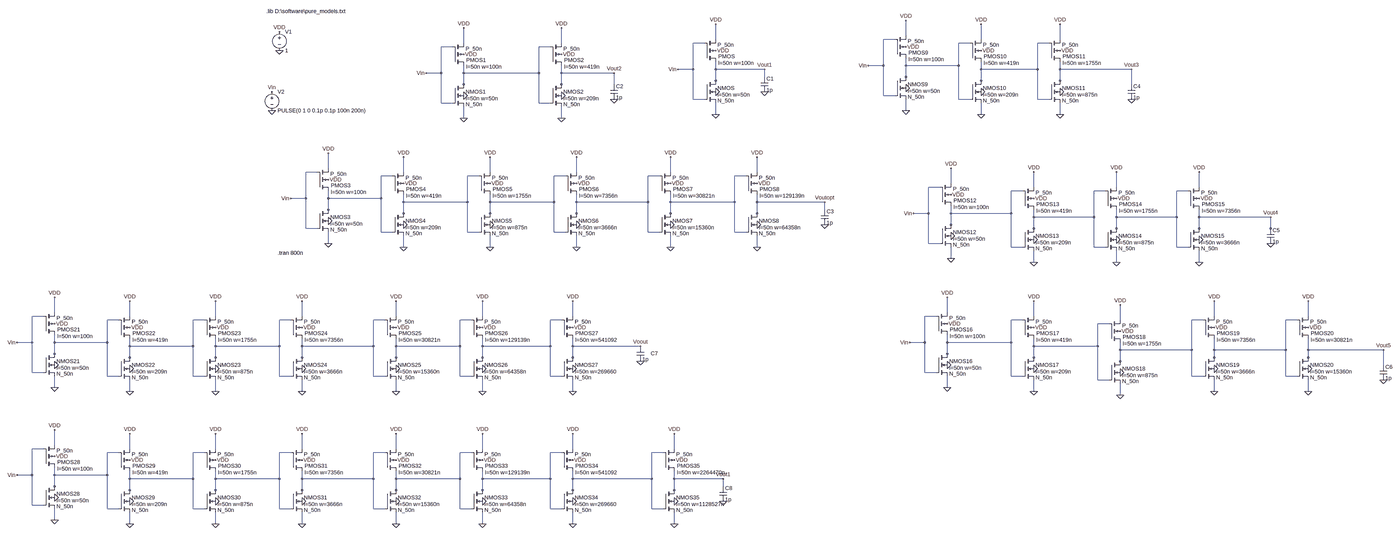
[diagram p0: schematic lab05a2.asc, whole sheet]
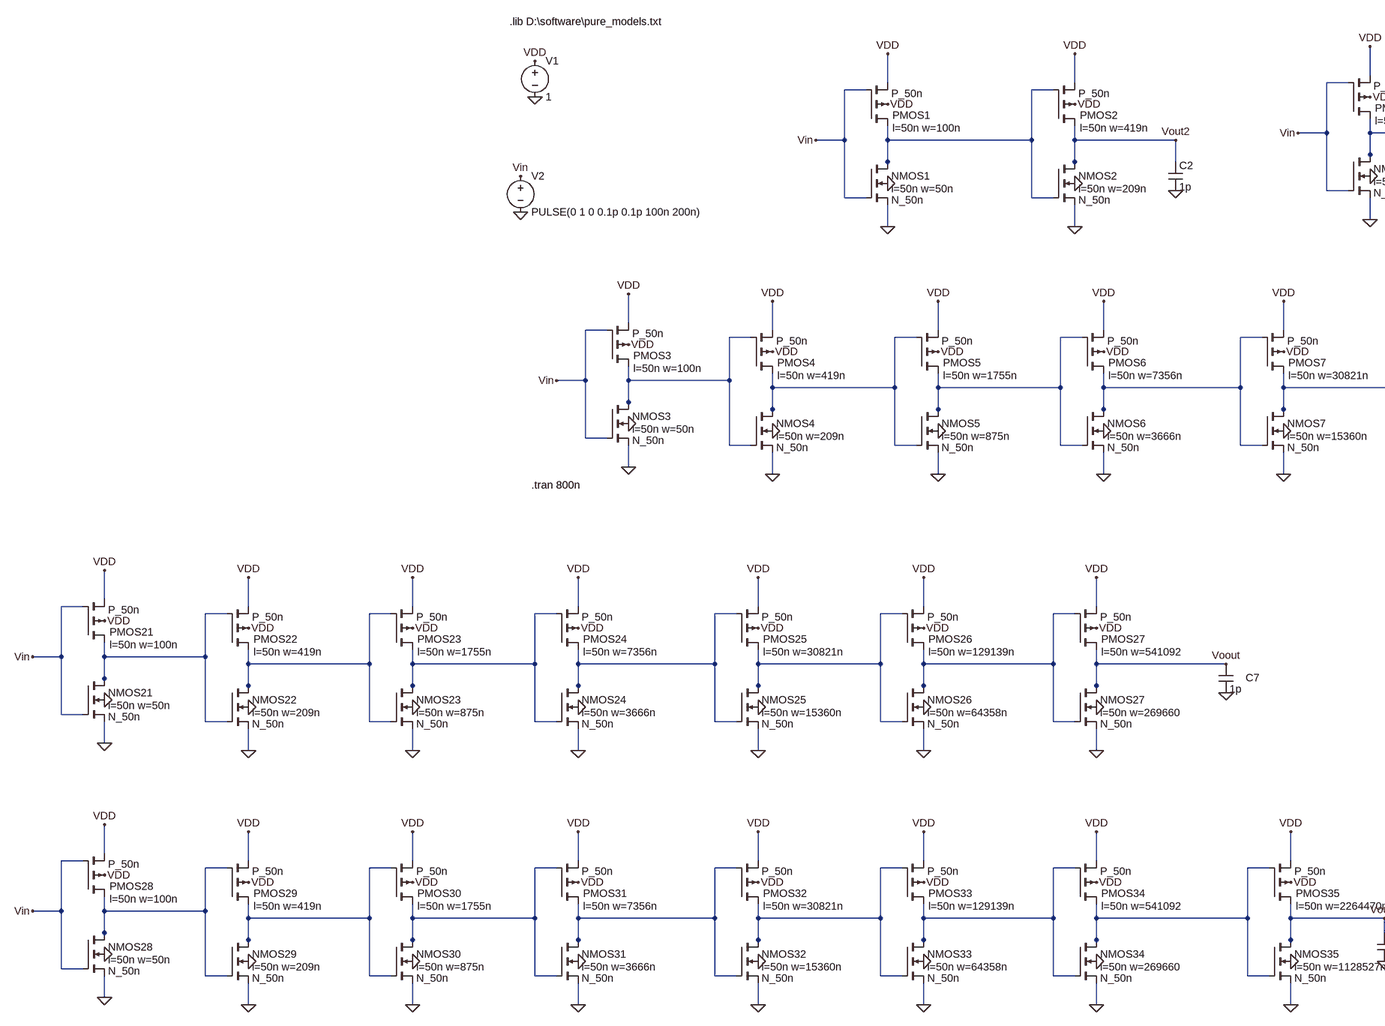
[diagram p1: schematic lab05a2.asc, part, row 1 of 1, column 1 of 2]
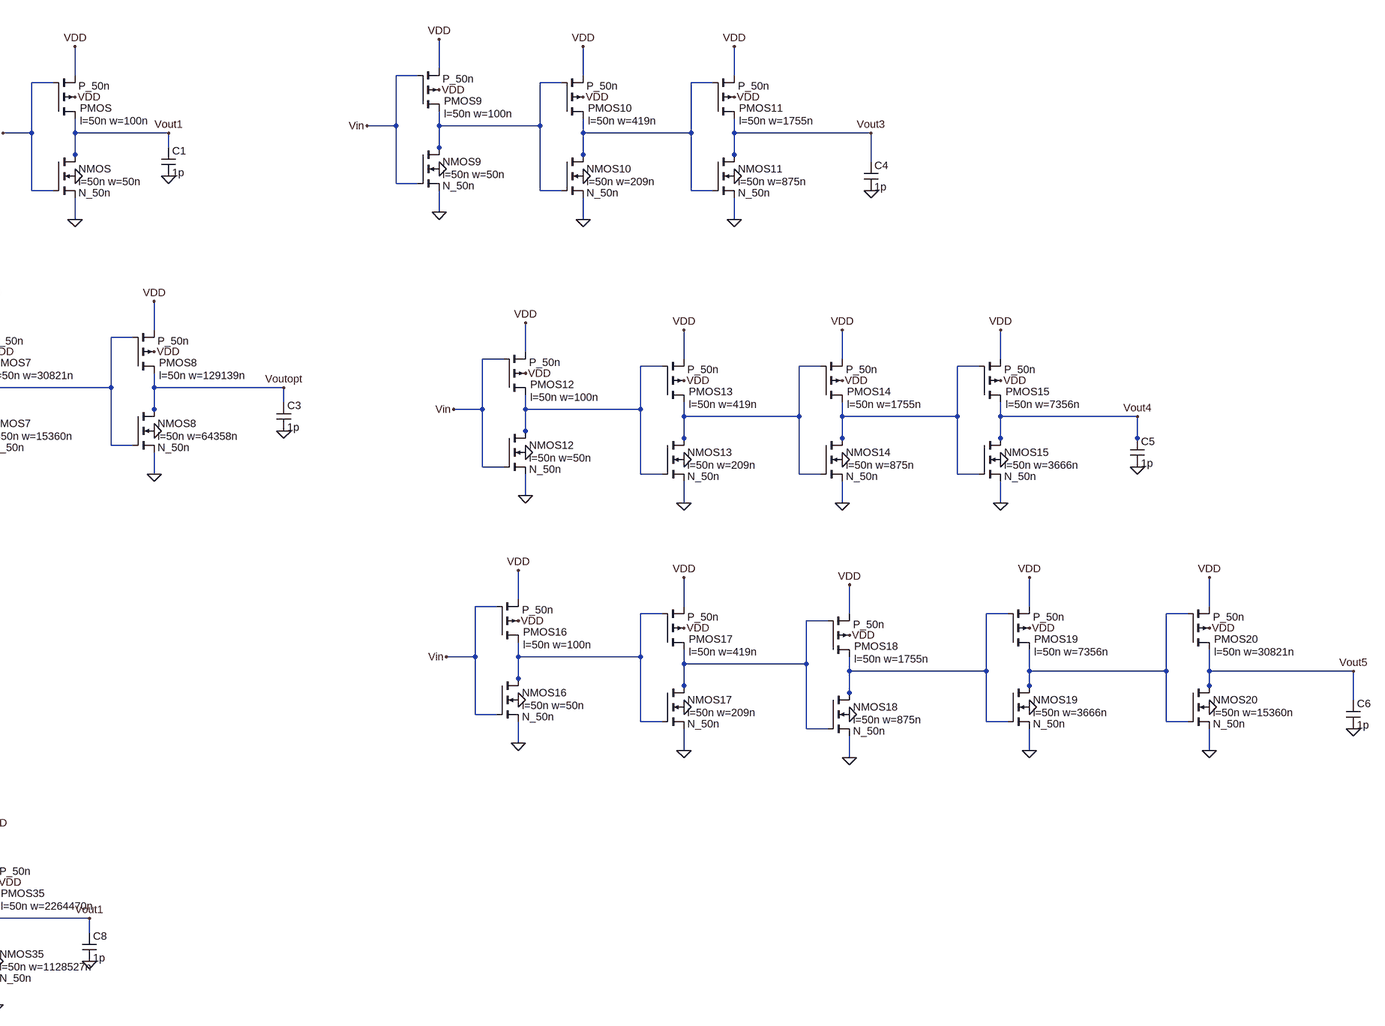
[diagram p2: schematic lab05a2.asc, part, row 1 of 1, column 2 of 2]
lab05a2.asc, the LTspice schematic file:
Version 4
SHEET 1 3972 2004
WIRE 1888 -352 1888 -416
WIRE 992 -336 992 -400
WIRE 1840 -336 1792 -336
WIRE 2208 -336 2208 -400
WIRE 2544 -336 2544 -400
WIRE -80 -320 -80 -384
WIRE 336 -320 336 -384
WIRE 944 -320 896 -320
WIRE 2160 -320 2112 -320
WIRE 2496 -320 2448 -320
WIRE -128 -304 -176 -304
WIRE 288 -304 240 -304
WIRE 1792 -224 1792 -336
WIRE 1792 -224 1728 -224
WIRE 1888 -224 1888 -256
WIRE 2112 -224 2112 -320
WIRE 2112 -224 1888 -224
WIRE 896 -208 896 -320
WIRE 896 -208 832 -208
WIRE 992 -208 992 -240
WIRE 1200 -208 992 -208
WIRE 2208 -208 2208 -240
WIRE 2448 -208 2448 -320
WIRE 2448 -208 2208 -208
WIRE 2544 -208 2544 -240
WIRE 2848 -208 2544 -208
WIRE -176 -192 -176 -304
WIRE -176 -192 -240 -192
WIRE -80 -192 -80 -224
WIRE 240 -192 240 -304
WIRE 240 -192 -80 -192
WIRE 336 -192 336 -224
WIRE 560 -192 336 -192
WIRE 1200 -176 1200 -208
WIRE 1888 -176 1888 -224
WIRE 992 -160 992 -208
WIRE 1888 -160 1888 -176
WIRE 2208 -160 2208 -208
WIRE 2544 -160 2544 -208
WIRE -80 -144 -80 -192
WIRE 336 -144 336 -192
WIRE 560 -144 560 -192
WIRE 992 -144 992 -160
WIRE 2208 -144 2208 -160
WIRE 2544 -144 2544 -160
WIRE 2848 -144 2848 -208
WIRE -80 -128 -80 -144
WIRE 336 -128 336 -144
WIRE 1792 -96 1792 -224
WIRE 1840 -96 1792 -96
WIRE 896 -80 896 -208
WIRE 944 -80 896 -80
WIRE 2112 -80 2112 -224
WIRE 2160 -80 2112 -80
WIRE 2448 -80 2448 -208
WIRE 2496 -80 2448 -80
WIRE -176 -64 -176 -192
WIRE -128 -64 -176 -64
WIRE 240 -64 240 -192
WIRE 288 -64 240 -64
WIRE 1888 -32 1888 -80
WIRE 992 -16 992 -64
WIRE 2208 -16 2208 -64
WIRE 2544 -16 2544 -64
WIRE -80 0 -80 -48
WIRE 336 0 336 -48
WIRE -656 304 -656 240
WIRE -704 320 -752 320
WIRE -336 320 -336 256
WIRE 32 320 32 256
WIRE 400 320 400 256
WIRE 800 320 800 256
WIRE 1168 320 1168 256
WIRE -384 336 -432 336
WIRE -16 336 -64 336
WIRE 352 336 304 336
WIRE 752 336 704 336
WIRE 1120 336 1072 336
WIRE 2080 368 2080 304
WIRE 2032 384 1984 384
WIRE 2432 384 2432 320
WIRE 2784 384 2784 320
WIRE 3136 384 3136 320
WIRE 2384 400 2336 400
WIRE 2736 400 2688 400
WIRE 3088 400 3040 400
WIRE -752 432 -752 320
WIRE -752 432 -816 432
WIRE -656 432 -656 400
WIRE -432 432 -432 336
WIRE -432 432 -656 432
WIRE -336 448 -336 416
WIRE -64 448 -64 336
WIRE -64 448 -336 448
WIRE 32 448 32 416
WIRE 304 448 304 336
WIRE 304 448 32 448
WIRE 400 448 400 416
WIRE 704 448 704 336
WIRE 704 448 400 448
WIRE 800 448 800 416
WIRE 1072 448 1072 336
WIRE 1072 448 800 448
WIRE 1168 448 1168 416
WIRE 1456 448 1168 448
WIRE -656 480 -656 432
WIRE 1456 480 1456 448
WIRE -656 496 -656 480
WIRE -336 496 -336 448
WIRE 32 496 32 448
WIRE 400 496 400 448
WIRE 800 496 800 448
WIRE 1168 496 1168 448
WIRE 1984 496 1984 384
WIRE 1984 496 1920 496
WIRE 2080 496 2080 464
WIRE 2336 496 2336 400
WIRE 2336 496 2080 496
WIRE -336 512 -336 496
WIRE 32 512 32 496
WIRE 400 512 400 496
WIRE 800 512 800 496
WIRE 1168 512 1168 496
WIRE 2432 512 2432 480
WIRE 2688 512 2688 400
WIRE 2688 512 2432 512
WIRE 2784 512 2784 480
WIRE 3040 512 3040 400
WIRE 3040 512 2784 512
WIRE 3136 512 3136 480
WIRE 3440 512 3136 512
WIRE 2080 544 2080 496
WIRE -752 560 -752 432
WIRE -704 560 -752 560
WIRE 2080 560 2080 544
WIRE 2432 560 2432 512
WIRE 2784 560 2784 512
WIRE 3136 560 3136 512
WIRE 3440 560 3440 512
WIRE -432 576 -432 432
WIRE -384 576 -432 576
WIRE -64 576 -64 448
WIRE -16 576 -64 576
WIRE 304 576 304 448
WIRE 352 576 304 576
WIRE 704 576 704 448
WIRE 752 576 704 576
WIRE 1072 576 1072 448
WIRE 1120 576 1072 576
WIRE 2432 576 2432 560
WIRE 2784 576 2784 560
WIRE 3136 576 3136 560
WIRE 3440 576 3440 560
WIRE -656 624 -656 576
WIRE 1984 624 1984 496
WIRE 2032 624 1984 624
WIRE -336 640 -336 592
WIRE 32 640 32 592
WIRE 400 640 400 592
WIRE 800 640 800 592
WIRE 1168 640 1168 592
WIRE 2336 640 2336 496
WIRE 2384 640 2336 640
WIRE 2688 640 2688 512
WIRE 2736 640 2688 640
WIRE 3040 640 3040 512
WIRE 3088 640 3040 640
WIRE 2080 688 2080 640
WIRE 2432 704 2432 656
WIRE 2784 704 2784 656
WIRE 3136 704 3136 656
WIRE -1824 1008 -1824 944
WIRE 2064 1008 2064 944
WIRE -1872 1024 -1920 1024
WIRE -1504 1024 -1504 960
WIRE -1136 1024 -1136 960
WIRE -768 1024 -768 960
WIRE -368 1024 -368 960
WIRE 0 1024 0 960
WIRE 384 1024 384 960
WIRE 2016 1024 1968 1024
WIRE 2432 1024 2432 960
WIRE 3200 1024 3200 960
WIRE 3600 1024 3600 960
WIRE -1552 1040 -1600 1040
WIRE -1184 1040 -1232 1040
WIRE -816 1040 -864 1040
WIRE -416 1040 -464 1040
WIRE -48 1040 -96 1040
WIRE 336 1040 288 1040
WIRE 2384 1040 2336 1040
WIRE 2800 1040 2800 976
WIRE 3152 1040 3104 1040
WIRE 3552 1040 3504 1040
WIRE 2752 1056 2704 1056
WIRE -1920 1136 -1920 1024
WIRE -1920 1136 -1984 1136
WIRE -1824 1136 -1824 1104
WIRE -1600 1136 -1600 1040
WIRE -1600 1136 -1824 1136
WIRE 1968 1136 1968 1024
WIRE 1968 1136 1904 1136
WIRE 2064 1136 2064 1104
WIRE 2336 1136 2336 1040
WIRE 2336 1136 2064 1136
WIRE -1504 1152 -1504 1120
WIRE -1232 1152 -1232 1040
WIRE -1232 1152 -1504 1152
WIRE -1136 1152 -1136 1120
WIRE -864 1152 -864 1040
WIRE -864 1152 -1136 1152
WIRE -768 1152 -768 1120
WIRE -464 1152 -464 1040
WIRE -464 1152 -768 1152
WIRE -368 1152 -368 1120
WIRE -96 1152 -96 1040
WIRE -96 1152 -368 1152
WIRE 0 1152 0 1120
WIRE 288 1152 288 1040
WIRE 288 1152 0 1152
WIRE 384 1152 384 1120
WIRE 672 1152 384 1152
WIRE 2432 1152 2432 1120
WIRE 2704 1152 2704 1056
WIRE 2704 1152 2432 1152
WIRE 2800 1168 2800 1136
WIRE 3104 1168 3104 1040
WIRE 3104 1168 2800 1168
WIRE 3200 1168 3200 1120
WIRE 3504 1168 3504 1040
WIRE 3504 1168 3200 1168
WIRE 3600 1168 3600 1120
WIRE 3920 1168 3600 1168
WIRE -1824 1184 -1824 1136
WIRE 2064 1184 2064 1136
WIRE -1824 1200 -1824 1184
WIRE -1504 1200 -1504 1152
WIRE -1136 1200 -1136 1152
WIRE -768 1200 -768 1152
WIRE -368 1200 -368 1152
WIRE 0 1200 0 1152
WIRE 384 1200 384 1152
WIRE 2064 1200 2064 1184
WIRE 2432 1200 2432 1152
WIRE 3200 1200 3200 1168
WIRE 3600 1200 3600 1168
WIRE -1504 1216 -1504 1200
WIRE -1136 1216 -1136 1200
WIRE -768 1216 -768 1200
WIRE -368 1216 -368 1200
WIRE 0 1216 0 1200
WIRE 384 1216 384 1200
WIRE 2432 1216 2432 1200
WIRE 2800 1216 2800 1168
WIRE 3200 1216 3200 1200
WIRE 3600 1216 3600 1200
WIRE 2800 1232 2800 1216
WIRE 3920 1232 3920 1168
WIRE -1920 1264 -1920 1136
WIRE -1872 1264 -1920 1264
WIRE 1968 1264 1968 1136
WIRE 2016 1264 1968 1264
WIRE -1600 1280 -1600 1136
WIRE -1552 1280 -1600 1280
WIRE -1232 1280 -1232 1152
WIRE -1184 1280 -1232 1280
WIRE -864 1280 -864 1152
WIRE -816 1280 -864 1280
WIRE -464 1280 -464 1152
WIRE -416 1280 -464 1280
WIRE -96 1280 -96 1152
WIRE -48 1280 -96 1280
WIRE 288 1280 288 1152
WIRE 336 1280 288 1280
WIRE 2336 1280 2336 1136
WIRE 2384 1280 2336 1280
WIRE 3104 1280 3104 1168
WIRE 3152 1280 3104 1280
WIRE 3504 1280 3504 1168
WIRE 3552 1280 3504 1280
WIRE 2704 1296 2704 1152
WIRE 2752 1296 2704 1296
WIRE -1824 1328 -1824 1280
WIRE 2064 1328 2064 1280
WIRE -1504 1344 -1504 1296
WIRE -1136 1344 -1136 1296
WIRE -768 1344 -768 1296
WIRE -368 1344 -368 1296
WIRE 0 1344 0 1296
WIRE 384 1344 384 1296
WIRE 2432 1344 2432 1296
WIRE 3200 1344 3200 1296
WIRE 3600 1344 3600 1296
WIRE 2800 1360 2800 1312
WIRE -1824 1648 -1824 1584
WIRE -1872 1664 -1920 1664
WIRE -1504 1664 -1504 1600
WIRE -1136 1664 -1136 1600
WIRE -768 1664 -768 1600
WIRE -368 1664 -368 1600
WIRE 0 1664 0 1600
WIRE 384 1664 384 1600
WIRE 816 1664 816 1600
WIRE -1552 1680 -1600 1680
WIRE -1184 1680 -1232 1680
WIRE -816 1680 -864 1680
WIRE -416 1680 -464 1680
WIRE -48 1680 -96 1680
WIRE 336 1680 288 1680
WIRE 768 1680 720 1680
WIRE -1920 1776 -1920 1664
WIRE -1920 1776 -1984 1776
WIRE -1824 1776 -1824 1744
WIRE -1600 1776 -1600 1680
WIRE -1600 1776 -1824 1776
WIRE -1504 1792 -1504 1760
WIRE -1232 1792 -1232 1680
WIRE -1232 1792 -1504 1792
WIRE -1136 1792 -1136 1760
WIRE -864 1792 -864 1680
WIRE -864 1792 -1136 1792
WIRE -768 1792 -768 1760
WIRE -464 1792 -464 1680
WIRE -464 1792 -768 1792
WIRE -368 1792 -368 1760
WIRE -96 1792 -96 1680
WIRE -96 1792 -368 1792
WIRE 0 1792 0 1760
WIRE 288 1792 288 1680
WIRE 288 1792 0 1792
WIRE 384 1792 384 1760
WIRE 720 1792 720 1680
WIRE 720 1792 384 1792
WIRE 816 1792 816 1760
WIRE 1024 1792 816 1792
WIRE -1824 1824 -1824 1776
WIRE 1024 1824 1024 1792
WIRE -1824 1840 -1824 1824
WIRE -1504 1840 -1504 1792
WIRE -1136 1840 -1136 1792
WIRE -768 1840 -768 1792
WIRE -368 1840 -368 1792
WIRE 0 1840 0 1792
WIRE 384 1840 384 1792
WIRE 816 1840 816 1792
WIRE -1504 1856 -1504 1840
WIRE -1136 1856 -1136 1840
WIRE -768 1856 -768 1840
WIRE -368 1856 -368 1840
WIRE 0 1856 0 1840
WIRE 384 1856 384 1840
WIRE 816 1856 816 1840
WIRE -1920 1904 -1920 1776
WIRE -1872 1904 -1920 1904
WIRE -1600 1920 -1600 1776
WIRE -1552 1920 -1600 1920
WIRE -1232 1920 -1232 1792
WIRE -1184 1920 -1232 1920
WIRE -864 1920 -864 1792
WIRE -816 1920 -864 1920
WIRE -464 1920 -464 1792
WIRE -416 1920 -464 1920
WIRE -96 1920 -96 1792
WIRE -48 1920 -96 1920
WIRE 288 1920 288 1792
WIRE 336 1920 288 1920
WIRE 720 1920 720 1792
WIRE 768 1920 720 1920
WIRE -1824 1968 -1824 1920
WIRE -1504 1984 -1504 1936
WIRE -1136 1984 -1136 1936
WIRE -768 1984 -768 1936
WIRE -368 1984 -368 1936
WIRE 0 1984 0 1936
WIRE 384 1984 384 1936
WIRE 816 1984 816 1936
FLAG 992 -16 0
FLAG -896 -32 0
FLAG -864 -288 0
FLAG -864 -368 VDD
FLAG 992 -400 VDD
FLAG 992 -288 VDD
FLAG 992 -112 0
FLAG -896 -112 Vin
FLAG 832 -208 Vin
FLAG 1200 -112 0
FLAG -80 0 0
FLAG -80 -384 VDD
FLAG -80 -272 VDD
FLAG -80 -96 0
FLAG -240 -192 Vin
FLAG 336 0 0
FLAG 336 -384 VDD
FLAG 336 -272 VDD
FLAG 336 -96 0
FLAG 1200 -208 Vout1
FLAG 560 -80 0
FLAG -656 624 0
FLAG -656 240 VDD
FLAG -656 352 VDD
FLAG -656 528 0
FLAG -816 432 Vin
FLAG -336 640 0
FLAG -336 256 VDD
FLAG -336 368 VDD
FLAG -336 544 0
FLAG 32 640 0
FLAG 32 256 VDD
FLAG 32 368 VDD
FLAG 32 544 0
FLAG 400 640 0
FLAG 400 256 VDD
FLAG 400 368 VDD
FLAG 400 544 0
FLAG 800 640 0
FLAG 800 256 VDD
FLAG 800 368 VDD
FLAG 800 544 0
FLAG 1168 640 0
FLAG 1168 256 VDD
FLAG 1168 368 VDD
FLAG 1168 544 0
FLAG 1456 544 0
FLAG 1456 448 Voutopt
FLAG 1888 -32 0
FLAG 1888 -416 VDD
FLAG 1888 -304 VDD
FLAG 1888 -128 0
FLAG 1728 -224 Vin
FLAG 2208 -16 0
FLAG 2208 -400 VDD
FLAG 2208 -288 VDD
FLAG 2208 -112 0
FLAG 2544 -16 0
FLAG 2544 -400 VDD
FLAG 2544 -288 VDD
FLAG 2544 -112 0
FLAG 2848 -80 0
FLAG 2080 688 0
FLAG 2080 304 VDD
FLAG 2080 416 VDD
FLAG 2080 592 0
FLAG 1920 496 Vin
FLAG 2432 704 0
FLAG 2432 320 VDD
FLAG 2432 432 VDD
FLAG 2432 608 0
FLAG 2784 704 0
FLAG 2784 320 VDD
FLAG 2784 432 VDD
FLAG 2784 608 0
FLAG 3136 704 0
FLAG 3136 320 VDD
FLAG 3136 432 VDD
FLAG 3136 608 0
FLAG 3440 624 0
FLAG 2064 1328 0
FLAG 2064 944 VDD
FLAG 2064 1056 VDD
FLAG 2064 1232 0
FLAG 1904 1136 Vin
FLAG 2432 1344 0
FLAG 2432 960 VDD
FLAG 2432 1072 VDD
FLAG 2432 1248 0
FLAG 2800 1360 0
FLAG 2800 976 VDD
FLAG 2800 1088 VDD
FLAG 2800 1264 0
FLAG 3200 1344 0
FLAG 3200 960 VDD
FLAG 3200 1072 VDD
FLAG 3200 1248 0
FLAG 3600 1344 0
FLAG 3600 960 VDD
FLAG 3600 1072 VDD
FLAG 3600 1248 0
FLAG 3920 1296 0
FLAG 560 -192 Vout2
FLAG 2848 -208 Vout3
FLAG 3440 512 Vout4
FLAG 3920 1168 Vout5
FLAG -1824 1328 0
FLAG -1824 944 VDD
FLAG -1824 1056 VDD
FLAG -1824 1232 0
FLAG -1984 1136 Vin
FLAG -1504 1344 0
FLAG -1504 960 VDD
FLAG -1504 1072 VDD
FLAG -1504 1248 0
FLAG -1136 1344 0
FLAG -1136 960 VDD
FLAG -1136 1072 VDD
FLAG -1136 1248 0
FLAG -768 1344 0
FLAG -768 960 VDD
FLAG -768 1072 VDD
FLAG -768 1248 0
FLAG -368 1344 0
FLAG -368 960 VDD
FLAG -368 1072 VDD
FLAG -368 1248 0
FLAG 0 1344 0
FLAG 0 960 VDD
FLAG 0 1072 VDD
FLAG 0 1248 0
FLAG 384 1344 0
FLAG 384 960 VDD
FLAG 384 1072 VDD
FLAG 384 1248 0
FLAG 672 1216 0
FLAG 672 1152 Voout
FLAG -1824 1968 0
FLAG -1824 1584 VDD
FLAG -1824 1696 VDD
FLAG -1824 1872 0
FLAG -1984 1776 Vin
FLAG -1504 1984 0
FLAG -1504 1600 VDD
FLAG -1504 1712 VDD
FLAG -1504 1888 0
FLAG -1136 1984 0
FLAG -1136 1600 VDD
FLAG -1136 1712 VDD
FLAG -1136 1888 0
FLAG -768 1984 0
FLAG -768 1600 VDD
FLAG -768 1712 VDD
FLAG -768 1888 0
FLAG -368 1984 0
FLAG -368 1600 VDD
FLAG -368 1712 VDD
FLAG -368 1888 0
FLAG 0 1984 0
FLAG 0 1600 VDD
FLAG 0 1712 VDD
FLAG 0 1888 0
FLAG 384 1984 0
FLAG 384 1600 VDD
FLAG 384 1712 VDD
FLAG 384 1888 0
FLAG 816 1984 0
FLAG 816 1600 VDD
FLAG 816 1712 VDD
FLAG 816 1888 0
FLAG 1024 1888 0
FLAG 1024 1792 Vout1
SYMBOL pmos4 944 -240 M180
WINDOW 0 59 23 Left 2
WINDOW 123 59 -5 Left 2
SYMATTR InstName PMOS
SYMATTR Value2 l=50n w=100n
SYMATTR Value P_50n
SYMBOL nmos4 944 -160 R0
WINDOW 3 56 85 Left 2
WINDOW 123 56 60 Left 2
SYMATTR Value N_50n
SYMATTR Value2 l=50n w=50n
SYMATTR InstName NMOS
SYMBOL voltage -864 -384 R0
WINDOW 123 0 0 Left 0
WINDOW 39 0 0 Left 0
SYMATTR InstName V1
SYMATTR Value 1
SYMBOL voltage -896 -128 R0
WINDOW 123 0 0 Left 0
WINDOW 39 0 0 Left 0
SYMATTR InstName V2
SYMATTR Value PULSE(0 1 0 0.1p 0.1p 100n 200n)
SYMBOL cap 1184 -176 R0
SYMATTR InstName C1
SYMATTR Value 1p
SYMBOL pmos4 -128 -224 M180
WINDOW 0 59 23 Left 2
WINDOW 123 59 -5 Left 2
SYMATTR InstName PMOS1
SYMATTR Value2 l=50n w=100n
SYMATTR Value P_50n
SYMBOL nmos4 -128 -144 R0
WINDOW 3 56 85 Left 2
WINDOW 123 56 60 Left 2
SYMATTR Value N_50n
SYMATTR Value2 l=50n w=50n
SYMATTR InstName NMOS1
SYMBOL pmos4 288 -224 M180
WINDOW 0 59 23 Left 2
WINDOW 123 59 -5 Left 2
SYMATTR InstName PMOS2
SYMATTR Value2 l=50n w=419n
SYMATTR Value P_50n
SYMBOL nmos4 288 -144 R0
WINDOW 3 56 85 Left 2
WINDOW 123 56 60 Left 2
SYMATTR Value N_50n
SYMATTR Value2 l=50n w=209n
SYMATTR InstName NMOS2
SYMBOL cap 544 -144 R0
SYMATTR InstName C2
SYMATTR Value 1p
SYMBOL pmos4 -704 400 M180
WINDOW 0 59 23 Left 2
WINDOW 123 59 -5 Left 2
SYMATTR InstName PMOS3
SYMATTR Value2 l=50n w=100n
SYMATTR Value P_50n
SYMBOL nmos4 -704 480 R0
WINDOW 3 56 85 Left 2
WINDOW 123 56 60 Left 2
SYMATTR Value N_50n
SYMATTR Value2 l=50n w=50n
SYMATTR InstName NMOS3
SYMBOL pmos4 -384 416 M180
WINDOW 0 59 23 Left 2
WINDOW 123 59 -5 Left 2
SYMATTR InstName PMOS4
SYMATTR Value2 l=50n w=419n
SYMATTR Value P_50n
SYMBOL nmos4 -384 496 R0
WINDOW 3 56 85 Left 2
WINDOW 123 56 60 Left 2
SYMATTR Value N_50n
SYMATTR Value2 l=50n w=209n
SYMATTR InstName NMOS4
SYMBOL pmos4 -16 416 M180
WINDOW 0 59 23 Left 2
WINDOW 123 59 -5 Left 2
SYMATTR InstName PMOS5
SYMATTR Value2 l=50n w=1755n
SYMATTR Value P_50n
SYMBOL nmos4 -16 496 R0
WINDOW 3 56 85 Left 2
WINDOW 123 56 60 Left 2
SYMATTR Value N_50n
SYMATTR Value2 l=50n w=875n
SYMATTR InstName NMOS5
SYMBOL pmos4 352 416 M180
WINDOW 0 59 23 Left 2
WINDOW 123 59 -5 Left 2
SYMATTR InstName PMOS6
SYMATTR Value2 l=50n w=7356n
SYMATTR Value P_50n
SYMBOL nmos4 352 496 R0
WINDOW 3 56 85 Left 2
WINDOW 123 56 60 Left 2
SYMATTR Value N_50n
SYMATTR Value2 l=50n w=3666n
SYMATTR InstName NMOS6
SYMBOL pmos4 752 416 M180
WINDOW 0 59 23 Left 2
WINDOW 123 59 -5 Left 2
SYMATTR InstName PMOS7
SYMATTR Value2 l=50n w=30821n
SYMATTR Value P_50n
SYMBOL nmos4 752 496 R0
WINDOW 3 56 85 Left 2
WINDOW 123 56 60 Left 2
SYMATTR Value N_50n
SYMATTR Value2 l=50n w=15360n
SYMATTR InstName NMOS7
SYMBOL pmos4 1120 416 M180
WINDOW 0 59 23 Left 2
WINDOW 123 59 -5 Left 2
SYMATTR InstName PMOS8
SYMATTR Value2 l=50n w=129139n
SYMATTR Value P_50n
SYMBOL nmos4 1120 496 R0
WINDOW 3 56 85 Left 2
WINDOW 123 56 60 Left 2
SYMATTR Value N_50n
SYMATTR Value2 l=50n w=64358n
SYMATTR InstName NMOS8
SYMBOL cap 1440 480 R0
SYMATTR InstName C3
SYMATTR Value 1p
SYMBOL pmos4 1840 -256 M180
WINDOW 0 59 23 Left 2
WINDOW 123 59 -5 Left 2
SYMATTR InstName PMOS9
SYMATTR Value2 l=50n w=100n
SYMATTR Value P_50n
SYMBOL nmos4 1840 -176 R0
WINDOW 3 56 85 Left 2
WINDOW 123 56 60 Left 2
SYMATTR Value N_50n
SYMATTR Value2 l=50n w=50n
SYMATTR InstName NMOS9
SYMBOL pmos4 2160 -240 M180
WINDOW 0 59 23 Left 2
WINDOW 123 59 -5 Left 2
SYMATTR InstName PMOS10
SYMATTR Value2 l=50n w=419n
SYMATTR Value P_50n
SYMBOL nmos4 2160 -160 R0
WINDOW 3 56 85 Left 2
WINDOW 123 56 60 Left 2
SYMATTR Value N_50n
SYMATTR Value2 l=50n w=209n
SYMATTR InstName NMOS10
SYMBOL pmos4 2496 -240 M180
WINDOW 0 59 23 Left 2
WINDOW 123 59 -5 Left 2
SYMATTR InstName PMOS11
SYMATTR Value2 l=50n w=1755n
SYMATTR Value P_50n
SYMBOL nmos4 2496 -160 R0
WINDOW 3 56 85 Left 2
WINDOW 123 56 60 Left 2
SYMATTR Value N_50n
SYMATTR Value2 l=50n w=875n
SYMATTR InstName NMOS11
SYMBOL cap 2832 -144 R0
SYMATTR InstName C4
SYMATTR Value 1p
SYMBOL pmos4 2032 464 M180
WINDOW 0 59 23 Left 2
WINDOW 123 59 -5 Left 2
SYMATTR InstName PMOS12
SYMATTR Value2 l=50n w=100n
SYMATTR Value P_50n
SYMBOL nmos4 2032 544 R0
WINDOW 3 56 85 Left 2
WINDOW 123 56 60 Left 2
SYMATTR Value N_50n
SYMATTR Value2 l=50n w=50n
SYMATTR InstName NMOS12
SYMBOL pmos4 2384 480 M180
WINDOW 0 59 23 Left 2
WINDOW 123 59 -5 Left 2
SYMATTR InstName PMOS13
SYMATTR Value2 l=50n w=419n
SYMATTR Value P_50n
SYMBOL nmos4 2384 560 R0
WINDOW 3 56 85 Left 2
WINDOW 123 56 60 Left 2
SYMATTR Value N_50n
SYMATTR Value2 l=50n w=209n
SYMATTR InstName NMOS13
SYMBOL pmos4 2736 480 M180
WINDOW 0 59 23 Left 2
WINDOW 123 59 -5 Left 2
SYMATTR InstName PMOS14
SYMATTR Value2 l=50n w=1755n
SYMATTR Value P_50n
SYMBOL nmos4 2736 560 R0
WINDOW 3 56 85 Left 2
WINDOW 123 56 60 Left 2
SYMATTR Value N_50n
SYMATTR Value2 l=50n w=875n
SYMATTR InstName NMOS14
SYMBOL pmos4 3088 480 M180
WINDOW 0 59 23 Left 2
WINDOW 123 59 -5 Left 2
SYMATTR InstName PMOS15
SYMATTR Value2 l=50n w=7356n
SYMATTR Value P_50n
SYMBOL nmos4 3088 560 R0
WINDOW 3 56 85 Left 2
WINDOW 123 56 60 Left 2
SYMATTR Value N_50n
SYMATTR Value2 l=50n w=3666n
SYMATTR InstName NMOS15
SYMBOL cap 3424 560 R0
SYMATTR InstName C5
SYMATTR Value 1p
SYMBOL pmos4 2016 1104 M180
WINDOW 0 59 23 Left 2
WINDOW 123 59 -5 Left 2
SYMATTR InstName PMOS16
SYMATTR Value2 l=50n w=100n
SYMATTR Value P_50n
SYMBOL nmos4 2016 1184 R0
WINDOW 3 56 85 Left 2
WINDOW 123 56 60 Left 2
SYMATTR Value N_50n
SYMATTR Value2 l=50n w=50n
SYMATTR InstName NMOS16
SYMBOL pmos4 2384 1120 M180
WINDOW 0 59 23 Left 2
WINDOW 123 59 -5 Left 2
SYMATTR InstName PMOS17
SYMATTR Value2 l=50n w=419n
SYMATTR Value P_50n
SYMBOL nmos4 2384 1200 R0
WINDOW 3 56 85 Left 2
WINDOW 123 56 60 Left 2
SYMATTR Value N_50n
SYMATTR Value2 l=50n w=209n
SYMATTR InstName NMOS17
SYMBOL pmos4 2752 1136 M180
WINDOW 0 59 23 Left 2
WINDOW 123 59 -5 Left 2
SYMATTR InstName PMOS18
SYMATTR Value2 l=50n w=1755n
SYMATTR Value P_50n
SYMBOL nmos4 2752 1216 R0
WINDOW 3 56 85 Left 2
WINDOW 123 56 60 Left 2
SYMATTR Value N_50n
SYMATTR Value2 l=50n w=875n
SYMATTR InstName NMOS18
SYMBOL pmos4 3152 1120 M180
WINDOW 0 59 23 Left 2
WINDOW 123 59 -5 Left 2
SYMATTR InstName PMOS19
SYMATTR Value2 l=50n w=7356n
SYMATTR Value P_50n
SYMBOL nmos4 3152 1200 R0
WINDOW 3 56 85 Left 2
WINDOW 123 56 60 Left 2
SYMATTR Value N_50n
SYMATTR Value2 l=50n w=3666n
SYMATTR InstName NMOS19
SYMBOL pmos4 3552 1120 M180
WINDOW 0 59 23 Left 2
WINDOW 123 59 -5 Left 2
SYMATTR InstName PMOS20
SYMATTR Value2 l=50n w=30821n
SYMATTR Value P_50n
SYMBOL nmos4 3552 1200 R0
WINDOW 3 56 85 Left 2
WINDOW 123 56 60 Left 2
SYMATTR Value N_50n
SYMATTR Value2 l=50n w=15360n
SYMATTR InstName NMOS20
SYMBOL cap 3904 1232 R0
SYMATTR InstName C6
SYMATTR Value 1p
SYMBOL pmos4 -1872 1104 M180
WINDOW 0 59 23 Left 2
WINDOW 123 59 -5 Left 2
SYMATTR InstName PMOS21
SYMATTR Value2 l=50n w=100n
SYMATTR Value P_50n
SYMBOL nmos4 -1872 1184 R0
WINDOW 3 56 85 Left 2
WINDOW 123 56 60 Left 2
SYMATTR Value N_50n
SYMATTR Value2 l=50n w=50n
SYMATTR InstName NMOS21
SYMBOL pmos4 -1552 1120 M180
WINDOW 0 59 23 Left 2
WINDOW 123 59 -5 Left 2
SYMATTR InstName PMOS22
SYMATTR Value2 l=50n w=419n
SYMATTR Value P_50n
SYMBOL nmos4 -1552 1200 R0
WINDOW 3 56 85 Left 2
WINDOW 123 56 60 Left 2
SYMATTR Value N_50n
SYMATTR Value2 l=50n w=209n
SYMATTR InstName NMOS22
SYMBOL pmos4 -1184 1120 M180
WINDOW 0 59 23 Left 2
WINDOW 123 59 -5 Left 2
SYMATTR InstName PMOS23
SYMATTR Value2 l=50n w=1755n
SYMATTR Value P_50n
SYMBOL nmos4 -1184 1200 R0
WINDOW 3 56 85 Left 2
WINDOW 123 56 60 Left 2
SYMATTR Value N_50n
SYMATTR Value2 l=50n w=875n
SYMATTR InstName NMOS23
SYMBOL pmos4 -816 1120 M180
WINDOW 0 59 23 Left 2
WINDOW 123 59 -5 Left 2
SYMATTR InstName PMOS24
SYMATTR Value2 l=50n w=7356n
SYMATTR Value P_50n
SYMBOL nmos4 -816 1200 R0
WINDOW 3 56 85 Left 2
WINDOW 123 56 60 Left 2
SYMATTR Value N_50n
SYMATTR Value2 l=50n w=3666n
SYMATTR InstName NMOS24
SYMBOL pmos4 -416 1120 M180
WINDOW 0 59 23 Left 2
WINDOW 123 59 -5 Left 2
SYMATTR InstName PMOS25
SYMATTR Value2 l=50n w=30821n
SYMATTR Value P_50n
SYMBOL nmos4 -416 1200 R0
WINDOW 3 56 85 Left 2
WINDOW 123 56 60 Left 2
SYMATTR Value N_50n
SYMATTR Value2 l=50n w=15360n
SYMATTR InstName NMOS25
SYMBOL pmos4 -48 1120 M180
WINDOW 0 59 23 Left 2
WINDOW 123 59 -5 Left 2
SYMATTR InstName PMOS26
SYMATTR Value2 l=50n w=129139n
SYMATTR Value P_50n
SYMBOL nmos4 -48 1200 R0
WINDOW 3 56 85 Left 2
WINDOW 123 56 60 Left 2
SYMATTR Value N_50n
SYMATTR Value2 l=50n w=64358n
SYMATTR InstName NMOS26
SYMBOL pmos4 336 1120 M180
WINDOW 0 59 23 Left 2
WINDOW 123 59 -5 Left 2
SYMATTR InstName PMOS27
SYMATTR Value2 l=50n w=541092
SYMATTR Value P_50n
SYMBOL nmos4 336 1200 R0
WINDOW 3 56 85 Left 2
WINDOW 123 56 60 Left 2
SYMATTR Value N_50n
SYMATTR Value2 l=50n w=269660
SYMATTR InstName NMOS27
SYMBOL cap 656 1152 R0
WINDOW 0 60 31 Left 2
SYMATTR InstName C7
SYMATTR Value 1p
SYMBOL pmos4 -1872 1744 M180
WINDOW 0 59 23 Left 2
WINDOW 123 59 -5 Left 2
SYMATTR InstName PMOS28
SYMATTR Value2 l=50n w=100n
SYMATTR Value P_50n
SYMBOL nmos4 -1872 1824 R0
WINDOW 3 56 85 Left 2
WINDOW 123 56 60 Left 2
SYMATTR Value N_50n
SYMATTR Value2 l=50n w=50n
SYMATTR InstName NMOS28
SYMBOL pmos4 -1552 1760 M180
WINDOW 0 59 23 Left 2
WINDOW 123 59 -5 Left 2
SYMATTR InstName PMOS29
SYMATTR Value2 l=50n w=419n
SYMATTR Value P_50n
SYMBOL nmos4 -1552 1840 R0
WINDOW 3 56 85 Left 2
WINDOW 123 56 60 Left 2
SYMATTR Value N_50n
SYMATTR Value2 l=50n w=209n
SYMATTR InstName NMOS29
SYMBOL pmos4 -1184 1760 M180
WINDOW 0 59 23 Left 2
WINDOW 123 59 -5 Left 2
SYMATTR InstName PMOS30
SYMATTR Value2 l=50n w=1755n
SYMATTR Value P_50n
SYMBOL nmos4 -1184 1840 R0
WINDOW 3 56 85 Left 2
WINDOW 123 56 60 Left 2
SYMATTR Value N_50n
SYMATTR Value2 l=50n w=875n
SYMATTR InstName NMOS30
SYMBOL pmos4 -816 1760 M180
WINDOW 0 59 23 Left 2
WINDOW 123 59 -5 Left 2
SYMATTR InstName PMOS31
SYMATTR Value2 l=50n w=7356n
SYMATTR Value P_50n
SYMBOL nmos4 -816 1840 R0
WINDOW 3 56 85 Left 2
WINDOW 123 56 60 Left 2
SYMATTR Value N_50n
SYMATTR Value2 l=50n w=3666n
SYMATTR InstName NMOS31
SYMBOL pmos4 -416 1760 M180
WINDOW 0 59 23 Left 2
WINDOW 123 59 -5 Left 2
SYMATTR InstName PMOS32
SYMATTR Value2 l=50n w=30821n
SYMATTR Value P_50n
SYMBOL nmos4 -416 1840 R0
WINDOW 3 56 85 Left 2
WINDOW 123 56 60 Left 2
SYMATTR Value N_50n
SYMATTR Value2 l=50n w=15360n
SYMATTR InstName NMOS32
SYMBOL pmos4 -48 1760 M180
WINDOW 0 59 23 Left 2
WINDOW 123 59 -5 Left 2
SYMATTR InstName PMOS33
SYMATTR Value2 l=50n w=129139n
SYMATTR Value P_50n
SYMBOL nmos4 -48 1840 R0
WINDOW 3 56 85 Left 2
WINDOW 123 56 60 Left 2
SYMATTR Value N_50n
SYMATTR Value2 l=50n w=64358n
SYMATTR InstName NMOS33
SYMBOL pmos4 336 1760 M180
WINDOW 0 59 23 Left 2
WINDOW 123 59 -5 Left 2
SYMATTR InstName PMOS34
SYMATTR Value2 l=50n w=541092
SYMATTR Value P_50n
SYMBOL nmos4 336 1840 R0
WINDOW 3 56 85 Left 2
WINDOW 123 56 60 Left 2
SYMATTR Value N_50n
SYMATTR Value2 l=50n w=269660
SYMATTR InstName NMOS34
SYMBOL pmos4 768 1760 M180
WINDOW 0 59 23 Left 2
WINDOW 123 59 -5 Left 2
SYMATTR InstName PMOS35
SYMATTR Value2 l=50n w=2264470n
SYMATTR Value P_50n
SYMBOL nmos4 768 1840 R0
WINDOW 3 56 85 Left 2
WINDOW 123 56 60 Left 2
SYMATTR Value N_50n
SYMATTR Value2 l=50n w=1128527n
SYMATTR InstName NMOS35
SYMBOL cap 1008 1824 R0
SYMATTR InstName C8
SYMATTR Value 1p
TEXT -920 -456 Left 2 !.lib D:\\software\\pure_models.txt
TEXT -872 664 Left 2 !.tran 800n

The netlist it stands for:
* lab05a2.asc
M§PMOS Vout1 Vin VDD VDD P_50n l=50n w=100n
M§NMOS Vout1 Vin 0 0 N_50n l=50n w=50n
V1 VDD 0 1
V2 Vin 0 PULSE(0 1 0 0.1p 0.1p 100n 200n)
C1 Vout1 0 1p
M§PMOS1 N003 Vin VDD VDD P_50n l=50n w=100n
M§NMOS1 N003 Vin 0 0 N_50n l=50n w=50n
M§PMOS2 Vout2 N003 VDD VDD P_50n l=50n w=419n
M§NMOS2 Vout2 N003 0 0 N_50n l=50n w=209n
C2 Vout2 0 1p
M§PMOS3 N004 Vin VDD VDD P_50n l=50n w=100n
M§NMOS3 N004 Vin 0 0 N_50n l=50n w=50n
M§PMOS4 N005 N004 VDD VDD P_50n l=50n w=419n
M§NMOS4 N005 N004 0 0 N_50n l=50n w=209n
M§PMOS5 N006 N005 VDD VDD P_50n l=50n w=1755n
M§NMOS5 N006 N005 0 0 N_50n l=50n w=875n
M§PMOS6 N007 N006 VDD VDD P_50n l=50n w=7356n
M§NMOS6 N007 N006 0 0 N_50n l=50n w=3666n
M§PMOS7 N008 N007 VDD VDD P_50n l=50n w=30821n
M§NMOS7 N008 N007 0 0 N_50n l=50n w=15360n
M§PMOS8 Voutopt N008 VDD VDD P_50n l=50n w=129139n
M§NMOS8 Voutopt N008 0 0 N_50n l=50n w=64358n
C3 Voutopt 0 1p
M§PMOS9 N001 Vin VDD VDD P_50n l=50n w=100n
M§NMOS9 N001 Vin 0 0 N_50n l=50n w=50n
M§PMOS10 N002 N001 VDD VDD P_50n l=50n w=419n
M§NMOS10 N002 N001 0 0 N_50n l=50n w=209n
M§PMOS11 Vout3 N002 VDD VDD P_50n l=50n w=1755n
M§NMOS11 Vout3 N002 0 0 N_50n l=50n w=875n
C4 Vout3 0 1p
M§PMOS12 N009 Vin VDD VDD P_50n l=50n w=100n
M§NMOS12 N009 Vin 0 0 N_50n l=50n w=50n
M§PMOS13 N010 N009 VDD VDD P_50n l=50n w=419n
M§NMOS13 N010 N009 0 0 N_50n l=50n w=209n
M§PMOS14 N011 N010 VDD VDD P_50n l=50n w=1755n
M§NMOS14 N011 N010 0 0 N_50n l=50n w=875n
M§PMOS15 Vout4 N011 VDD VDD P_50n l=50n w=7356n
M§NMOS15 Vout4 N011 0 0 N_50n l=50n w=3666n
C5 Vout4 0 1p
M§PMOS16 N018 Vin VDD VDD P_50n l=50n w=100n
M§NMOS16 N018 Vin 0 0 N_50n l=50n w=50n
M§PMOS17 N021 N018 VDD VDD P_50n l=50n w=419n
M§NMOS17 N021 N018 0 0 N_50n l=50n w=209n
M§PMOS18 N019 N021 VDD VDD P_50n l=50n w=1755n
M§NMOS18 N019 N021 0 0 N_50n l=50n w=875n
M§PMOS19 N020 N019 VDD VDD P_50n l=50n w=7356n
M§NMOS19 N020 N019 0 0 N_50n l=50n w=3666n
M§PMOS20 Vout5 N020 VDD VDD P_50n l=50n w=30821n
M§NMOS20 Vout5 N020 0 0 N_50n l=50n w=15360n
C6 Vout5 0 1p
M§PMOS21 N012 Vin VDD VDD P_50n l=50n w=100n
M§NMOS21 N012 Vin 0 0 N_50n l=50n w=50n
M§PMOS22 N013 N012 VDD VDD P_50n l=50n w=419n
M§NMOS22 N013 N012 0 0 N_50n l=50n w=209n
M§PMOS23 N014 N013 VDD VDD P_50n l=50n w=1755n
M§NMOS23 N014 N013 0 0 N_50n l=50n w=875n
M§PMOS24 N015 N014 VDD VDD P_50n l=50n w=7356n
M§NMOS24 N015 N014 0 0 N_50n l=50n w=3666n
M§PMOS25 N016 N015 VDD VDD P_50n l=50n w=30821n
M§NMOS25 N016 N015 0 0 N_50n l=50n w=15360n
M§PMOS26 N017 N016 VDD VDD P_50n l=50n w=129139n
M§NMOS26 N017 N016 0 0 N_50n l=50n w=64358n
M§PMOS27 Voout N017 VDD VDD P_50n l=50n w=541092
M§NMOS27 Voout N017 0 0 N_50n l=50n w=269660
C7 Voout 0 1p
M§PMOS28 N022 Vin VDD VDD P_50n l=50n w=100n
M§NMOS28 N022 Vin 0 0 N_50n l=50n w=50n
M§PMOS29 N023 N022 VDD VDD P_50n l=50n w=419n
M§NMOS29 N023 N022 0 0 N_50n l=50n w=209n
M§PMOS30 N024 N023 VDD VDD P_50n l=50n w=1755n
M§NMOS30 N024 N023 0 0 N_50n l=50n w=875n
M§PMOS31 N025 N024 VDD VDD P_50n l=50n w=7356n
M§NMOS31 N025 N024 0 0 N_50n l=50n w=3666n
M§PMOS32 N026 N025 VDD VDD P_50n l=50n w=30821n
M§NMOS32 N026 N025 0 0 N_50n l=50n w=15360n
M§PMOS33 N027 N026 VDD VDD P_50n l=50n w=129139n
M§NMOS33 N027 N026 0 0 N_50n l=50n w=64358n
M§PMOS34 N028 N027 VDD VDD P_50n l=50n w=541092
M§NMOS34 N028 N027 0 0 N_50n l=50n w=269660
M§PMOS35 Vout1 N028 VDD VDD P_50n l=50n w=2264470n
M§NMOS35 Vout1 N028 0 0 N_50n l=50n w=1128527n
C8 Vout1 0 1p
.model NMOS NMOS
.model PMOS PMOS
.lib standard.mos
.lib D:\software\pure_models.txt
.tran 800n
.backanno
.end